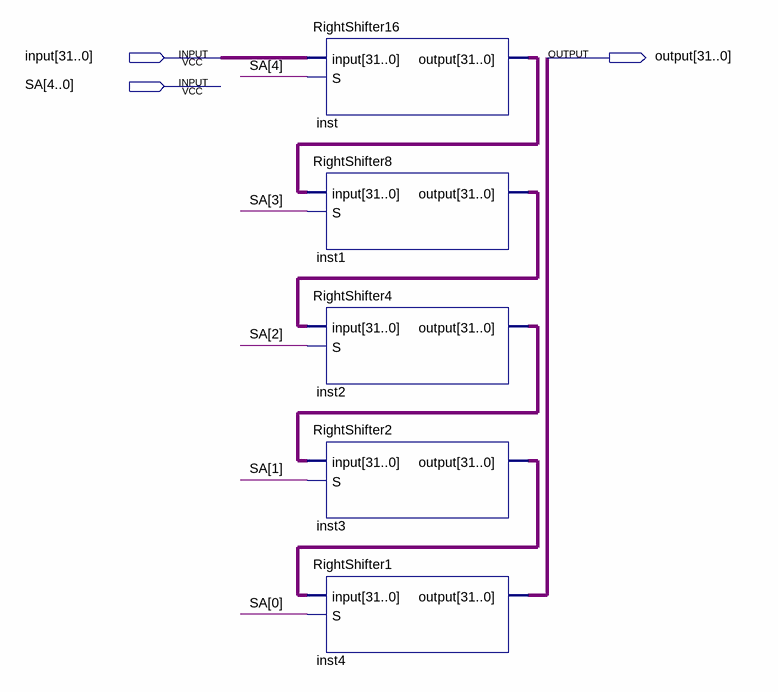
[diagram p0: schematic sheet]
// Quartus schematic RightShifter.bdf as structural Verilog: 5 symbols, 3 pins
module RightShifter (
  input  [31:0] \input ,
  input  [4:0] SA,
  output [31:0] \output 
);

  wire [31:0] inst1_output, inst2_output, inst3_output, inst_output;

  RightShifter16 inst (.\input (\input ), .S(SA[4]), .\output (inst_output));
  RightShifter8 inst1 (.\input (inst_output), .S(SA[3]), .\output (inst1_output));
  RightShifter4 inst2 (.\input (inst1_output), .S(SA[2]), .\output (inst2_output));
  RightShifter2 inst3 (.\input (inst2_output), .S(SA[1]), .\output (inst3_output));
  RightShifter1 inst4 (.\input (inst3_output), .S(SA[0]), .\output (\output ));
endmodule
